# EAGLE design brushless2 (EAGLE 5.10)
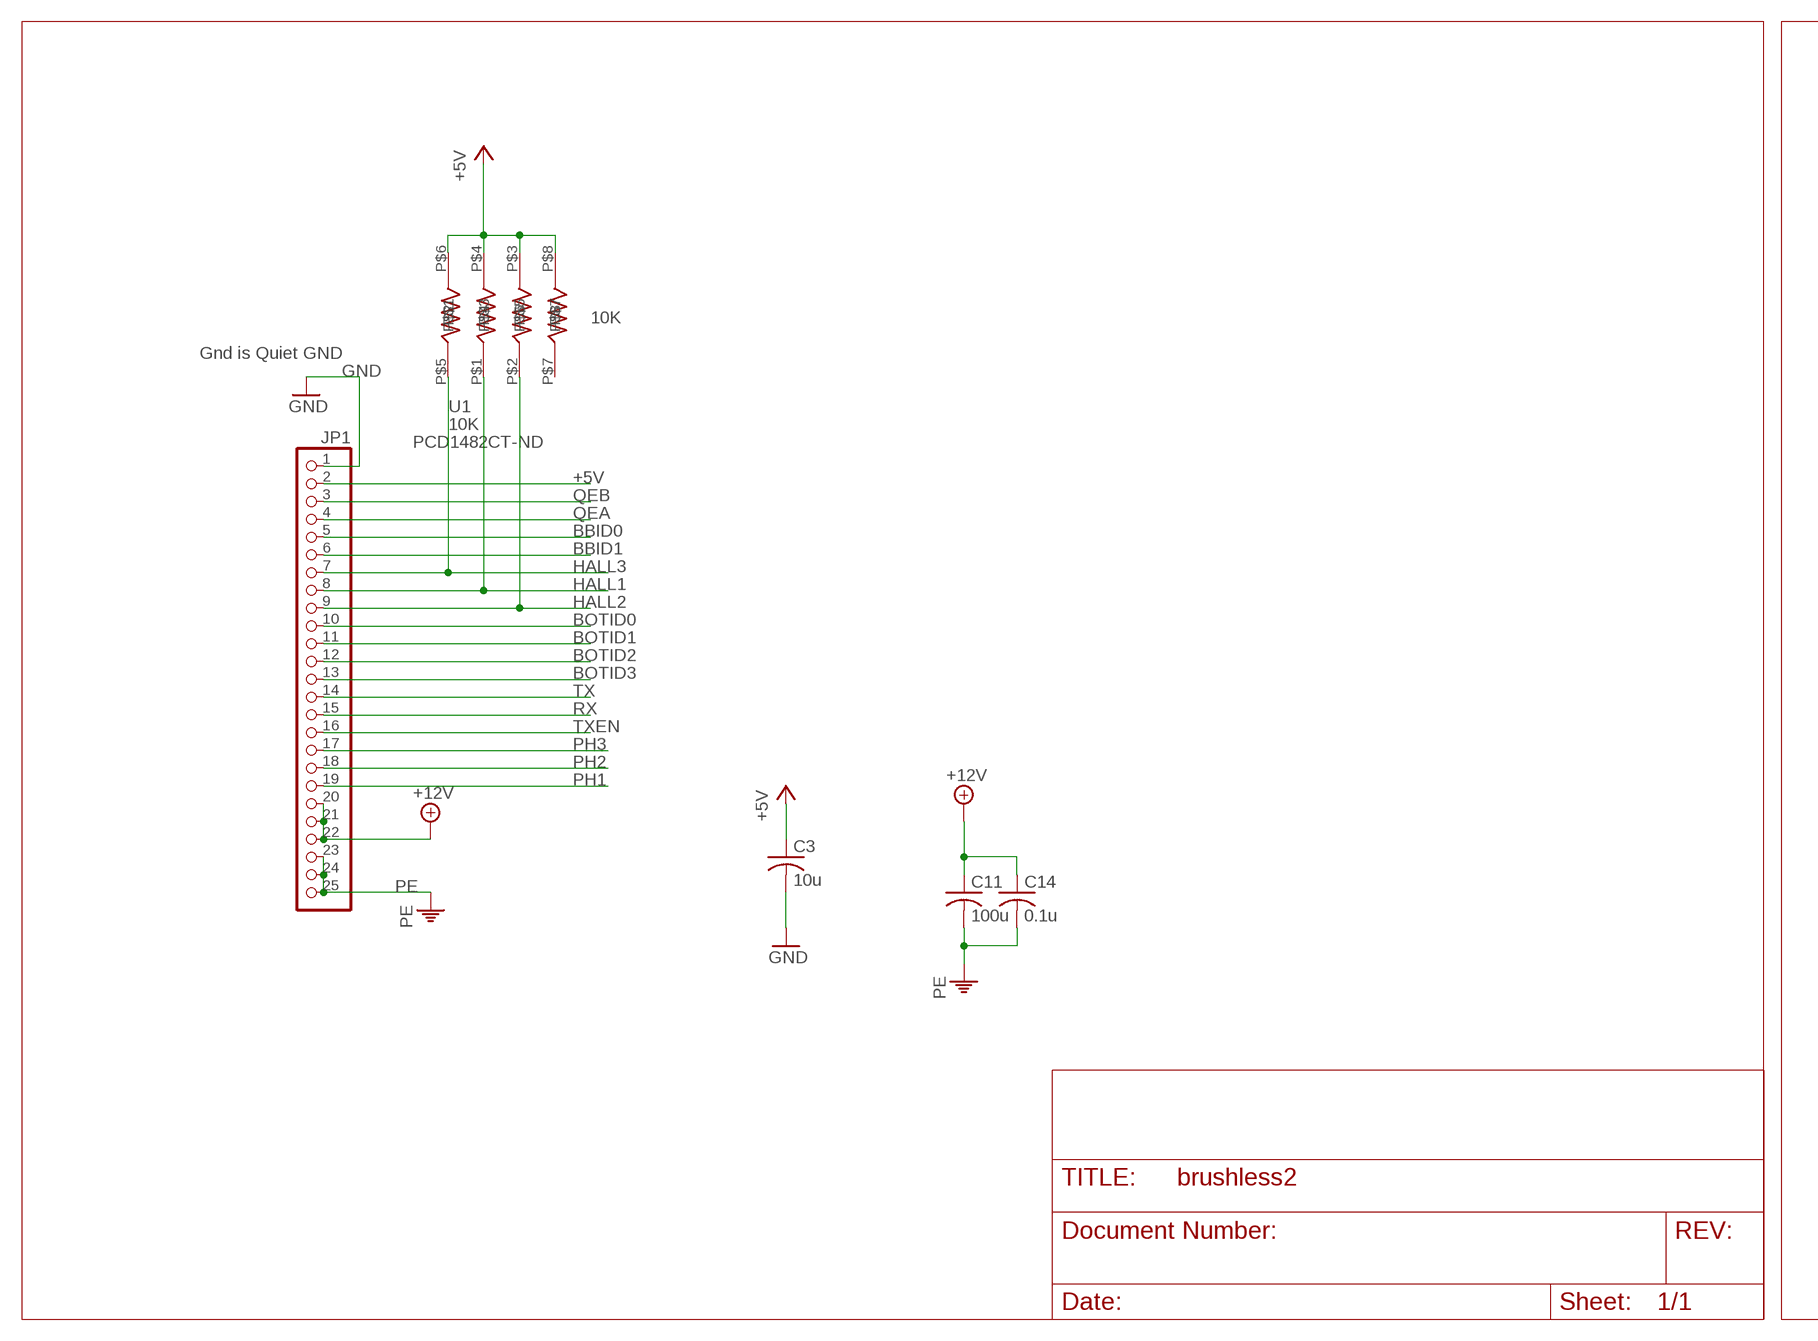
[diagram p0: schematic, sheet 1, part 1 of 2]
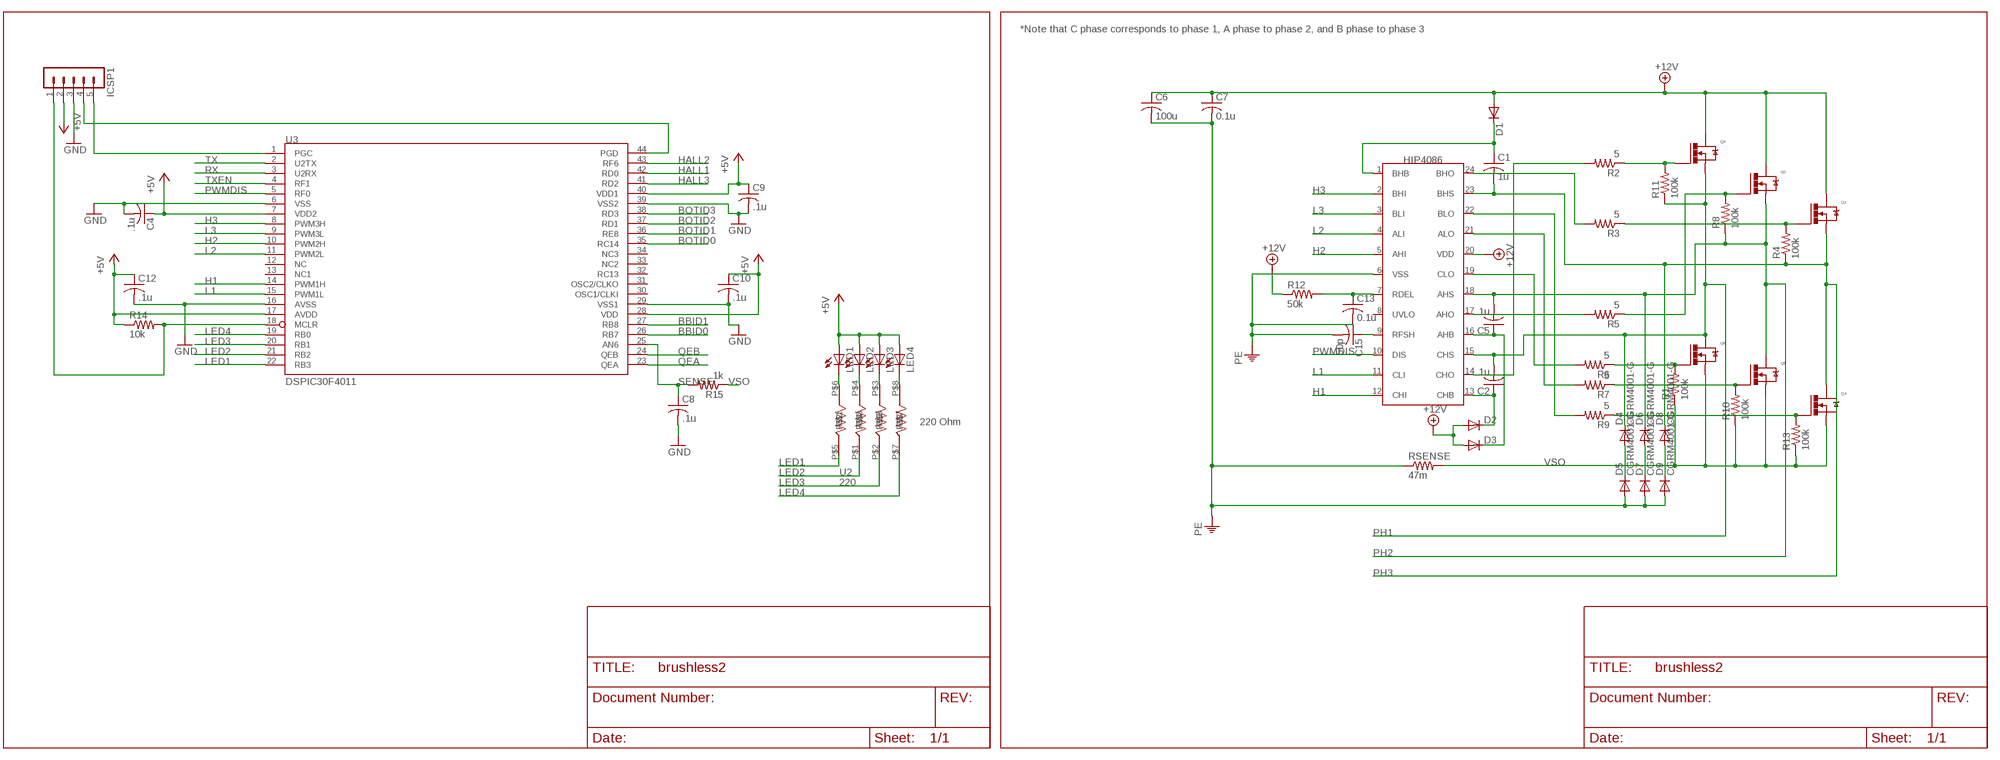
[diagram p1: schematic, sheet 1, part 2 of 2]

## Parts
C1  1u  C-USC1210  [C1210]
C2  1u  C-USC1210  [C1210]
C3  10u  C-USC1210  [C1210]
C4  .1u  C-USC0603  [C0603]
C5  1u  C-USC1210  [C1210]
C6  100u  C-USC2220K  [C2220K]
C7  0.1u  C-USC0805  [C0805]
C8  .1u  C-USC0603  [C0603]
C9  .1u  C-USC0603  [C0603]
C10  .1u  C-USC0603  [C0603]
C11  100u  C-USC2220K  [C2220K]
C12  .1u  C-USC0603  [C0603]
C13  0.1u  C-USC0805  [C0805]
C14  0.1u  C-USC0805  [C0805]
C15  50p  C-USC0805  [C0805]
D1  DIODE-MINIMELF  [MINIMELF]
D2  DIODE-MINIMELF  [MINIMELF]
D3  DIODE-MINIMELF  [MINIMELF]
D4  CGRM4001-G  [SOD-123_MINI-SMA]
D5  CGRM4001-G  [SOD-123_MINI-SMA]
D6  CGRM4001-G  [SOD-123_MINI-SMA]
D7  CGRM4001-G  [SOD-123_MINI-SMA]
D8  CGRM4001-G  [SOD-123_MINI-SMA]
D9  CGRM4001-G  [SOD-123_MINI-SMA]
ICSP1  MA05-1  [MA05-1]
JP1  PINHD-1X25  [1X25]
LED1  LEDCHIPLED_0805  [CHIPLED_0805]
LED2  LEDCHIPLED_0805  [CHIPLED_0805]
LED3  LEDCHIPLED_0805  [CHIPLED_0805]
LED4  LEDCHIPLED_0805  [CHIPLED_0805]
Q1  N-MOSFET  [DPAK]
Q2  N-MOSFET  [DPAK]
Q3  N-MOSFET  [DPAK]
Q4  N-MOSFET  [DPAK]
Q5  N-MOSFET  [DPAK]
Q6  N-MOSFET  [DPAK]
R1  100k  R-US_R0603  [R0603]
R2  5  R-US_R0603  [R0603]
R3  5  R-US_R0603  [R0603]
R4  100k  R-US_R0603  [R0603]
R5  5  R-US_R0603  [R0603]
R6  5  R-US_R0603  [R0603]
R7  5  R-US_R0603  [R0603]
R8  100k  R-US_R0603  [R0603]
R9  5  R-US_R0603  [R0603]
R10  100k  R-US_R0603  [R0603]
R11  100k  R-US_R0603  [R0603]
R12  50k  R-US_R0805  [R0805]
R13  100k  R-US_R0603  [R0603]
R14  10k  R-US_R0805  [R0805]
R15  1k  R-US_R0603  [R0603]
RSENSE  47m  R-US_R2010  [R2010]
U1  10K  YC164J-10KCT-ND  [0603X4]
U2  220  YC164J-10KCT-ND  [0603X4]
U3  DSPIC30F4011  [TQFP44]
U4  HIP4086  [HIP4086]

## Nets
+5V: C3.1 C4.1 C9.1 C10.1 C12.1 ICSP1.2 JP1.2 LED1.A LED2.A LED3.A LED4.A R14.1 U1.P$3 U1.P$4 U1.P$6 U1.P$8 U3.7(VDD2) U3.17(AVDD) U3.28(VDD) U3.40(VDD1)
+12V: C6.1 C7.1 C11.1 C14.1 D1.A D2.A D3.A JP1.20 JP1.21 JP1.22 Q1.DRAIN Q2.DRAIN Q3.DRAIN R12.1 U4.20(VDD)
BBID0: JP1.5 U3.26(RB7)
BBID1: JP1.6 U3.27(RB8)
BOTID0: JP1.10 U3.35(RC14)
BOTID1: JP1.11 U3.36(RE8)
BOTID2: JP1.12 U3.37(RD1)
BOTID3: JP1.13 U3.38(RD3)
GND: C3.2 C4.2 C8.2 C9.2 C10.2 C12.2 ICSP1.3 JP1.1 U3.6(VSS) U3.16(AVSS) U3.29(VSS1) U3.39(VSS2)
H1: U3.14(PWM1H) U4.12(CHI)
H2: U3.10(PWM2H) U4.5(AHI)
H3: U3.8(PWM3H) U4.2(BHI)
HALL1: JP1.8 U1.P$1 U3.42(RD0)
HALL2: JP1.9 U1.P$2 U3.43(RF6)
HALL3: JP1.7 U1.P$5 U3.41(RD2)
L1: U3.15(PWM1L) U4.11(CLI)
L2: U3.11(PWM2L) U4.4(ALI)
L3: U3.9(PWM3L) U4.3(BLI)
LED1: U2.P$5 U3.22(RB3)
LED2: U2.P$1 U3.21(RB2)
LED3: U2.P$2 U3.20(RB1)
LED4: U2.P$7 U3.19(RB0)
MCLR: ICSP1.1 R14.2 U3.18(MCLR)
N$1: C1.1 D1.C U4.1(BHB)
N$2: LED1.C U2.P$6
N$3: LED2.C U2.P$4
N$4: Q1.GATE R3.1 R4.2
N$5: R3.2 U4.24(BHO)
N$6: R9.2 U4.22(BLO)
N$8: LED3.C U2.P$3
N$9: R7.2 U4.21(ALO)
N$11: D4.A D5.C
N$12: Q5.GATE R7.1 R10.2
N$13: Q2.GATE R5.1 R8.2
N$14: R6.2 U4.19(CLO)
N$15: Q4.GATE R9.1 R13.2
N$16: C2.1 D2.C U4.13(CHB)
N$17: R2.2 U4.14(CHO)
N$18: R5.2 U4.17(AHO)
N$19: Q3.GATE R2.1 R11.2
N$20: C5.1 D3.C U4.16(AHB)
N$21: C15.1 U4.9(RFSH)
N$22: C13.1 R12.2 U4.7(RDEL)
N$23: D6.A D7.C
N$24: D8.A D9.C
N$26: LED4.C U2.P$8
N$29: Q6.GATE R1.2 R6.1
PE: C6.2 C7.2 C11.2 C13.2 C14.2 C15.2 D5.A D7.A D9.A JP1.23 JP1.24 JP1.25 RSENSE.1 U4.6(VSS)
PGC: ICSP1.5 U3.1(PGC)
PGD: ICSP1.4 U3.44(PGD)
PH1: C2.2 D4.C JP1.19 Q3.SOURCE Q6.DRAIN R11.1 U4.15(CHS)
PH2: C5.2 D6.C JP1.18 Q2.SOURCE Q5.DRAIN R8.1 U4.18(AHS)
PH3: C1.2 D8.C JP1.17 Q1.SOURCE Q4.DRAIN R4.1 U4.23(BHS)
PWMDIS: U3.5(RF0) U4.10(DIS)
QEA: JP1.4 U3.23(QEA)
QEB: JP1.3 U3.24(QEB)
RX: JP1.15 U3.3(U2RX)
SENSE: C8.1 R15.2 U3.25(AN6)
TX: JP1.14 U3.2(U2TX)
TXEN: JP1.16 U3.4(RF1)
VSO: Q4.SOURCE Q5.SOURCE Q6.SOURCE R1.1 R10.1 R13.1 R15.1 RSENSE.2
Unconnected: U1.P$7 U3.12(NC) U3.13(NC1) U3.30(OSC1/CLKI) U3.31(OSC2/CLKO) U3.32(RC13) U3.33(NC2) U3.34(NC3) U4.8(UVLO)

## Notes on the sheet
- *Note that C phase corresponds to phase 1, A phase to phase 2, and B phase to phase 3
- TX | HALL2 | HIP4086
- RX | HALL1
- 10K | TXEN | HALL3
- PWMDIS | H3
- Gnd is Quiet GND
- BOTID3 | L3
- H3 | BOTID2
- L3 | BOTID1 | L2
- H2 | BOTID0
- PCD1482CT-ND | L2 | H2
- +5V
- H1
- L1
- BBID1
- BBID0
- QEB | PWMDIS
- QEA
- L1
- SENSE | VSO
- H1
- 220 Ohm

## Library data of the parts
C1-C15 = rcl:C-US: CAPACITOR, American symbol
D1-D3 = diode:DIODE-: DIODE
D4-D9 = diode:CGRM400*-G: Molded plasitc,JEDEC SOD-123/Mini SMA Source: Comchip CGRM4001-G.pdf
ICSP1 = con-lstb:MA05-1: PIN HEADER
JP1 = pinhead:PINHD-1X25: PIN HEADER
LED1-LED4 = led:LED: LED OSRAM: - CHIPLED LG R971, LG N971, LY N971, LG Q971, LY Q971, LO R971, LY R971 LH N974, LH R974 LS Q976, LO Q976, LY Q976 LO Q996 - Hyper CHIPLED LW Q18S LB Q993, LB Q99A, LB R99A - SideLED LS A670, LO A670, LY A670, LG A670, LP A670 LB A673, LV A673, LT A673, LW A673 LH A674 LY A675 LS A676, LA A676, LO A676, LY A676, LW A676 LS A679, LY A679, LG A679 - Hyper Micro SIDELED® LS Y876, LA Y876, LO Y876, LY Y876 LT Y87S - SmartLED LW L88C, LW L88S LB L89C, LB L89S, LG L890 LS L89K, LO L89K, LY L89K LS L896, LA L896, LO L896, LY L896 - TOPLED LS T670, LO T670, LY T670, LG T670, LP T670 LSG T670, LSP T670, LSY T670, LOP T670, LYG T670 LG T671, LOG T671, LSG T671 LB T673, LV T673, LT T673, LW T673 LH T674 LS T676, LA T676, LO T676, LY T676, LB T676, LH T676, LSB T676, LW T676 LB T67C, LV T67C, LT T67C, LS T67K, LO T67K, LY T67K, LW E67C LS E67B, LA E67B, LO E67B, LY E67B, LB E67C, LV E67C, LT E67C LW T67C LS T679, LY T679, LG T679 LS T770, LO T770, LY T770, LG T770, LP T770 LB T773, LV T773, LT T773, LW T773 LH T774 LS E675, LA E675, LY E675, LS T675 LS T776, LA T776, LO T776, LY T776, LB T776 LHGB T686 LT T68C, LB T68C - Hyper Mini TOPLED® LB M676 - Mini TOPLED Santana® LG M470 LS M47K, LO M47K, LY M47K Source: http://www.osram.convergy.de LUXEON: - LUMILED® LXK2-PW12-R00, LXK2-PW12-S00, LXK2-PW14-U00, LXK2-PW14-V00 LXK2-PM12-R00, LXK2-PM12-S00, LXK2-PM14-U00 LXK2-PE12-Q00, LXK2-PE12-R00, LXK2-PE12-S00, LXK2-PE14-T00, LXK2-PE14-U00 LXK2-PB12-K00, LXK2-PB12-L00, LXK2-PB12-M00, LXK2-PB14-N00, LXK2-PB14-P00, LXK2-PB14-Q00 LXK2-PR12-L00, LXK2-PR12-M00, LXK2-PR14-Q00, LXK2-PR14-R00 LXK2-PD12-Q00, LXK2-PD12-R00, LXK2-PD12-S00 LXK2-PH12-R00, LXK2-PH12-S00 LXK2-PL12-P00, LXK2-PL12-Q00, LXK2-PL12-R00 Source: www.luxeon.com KINGBRIGHT: KA-3528ASYC Source: www.kingbright.com
Q1-Q6 = rfc:N-MOSFET: N-Channel Power Mosfet
R1-R15 RSENSE = rcl:R-US_: RESISTOR, American symbol
U1 U2 = rfc:YC164J-10KCT-ND: 4 pack of resistors
U3 = rfc:DSPIC30F4011
U4 = rfc:HIP4086

## Board
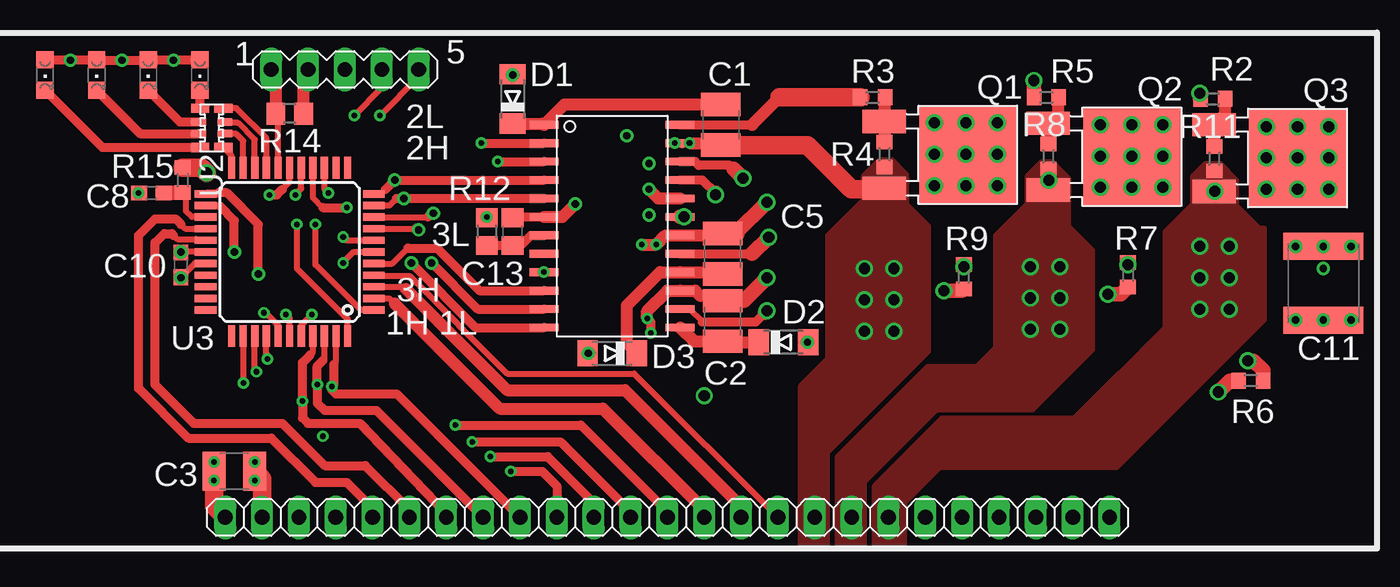
[diagram p2: board, top side]
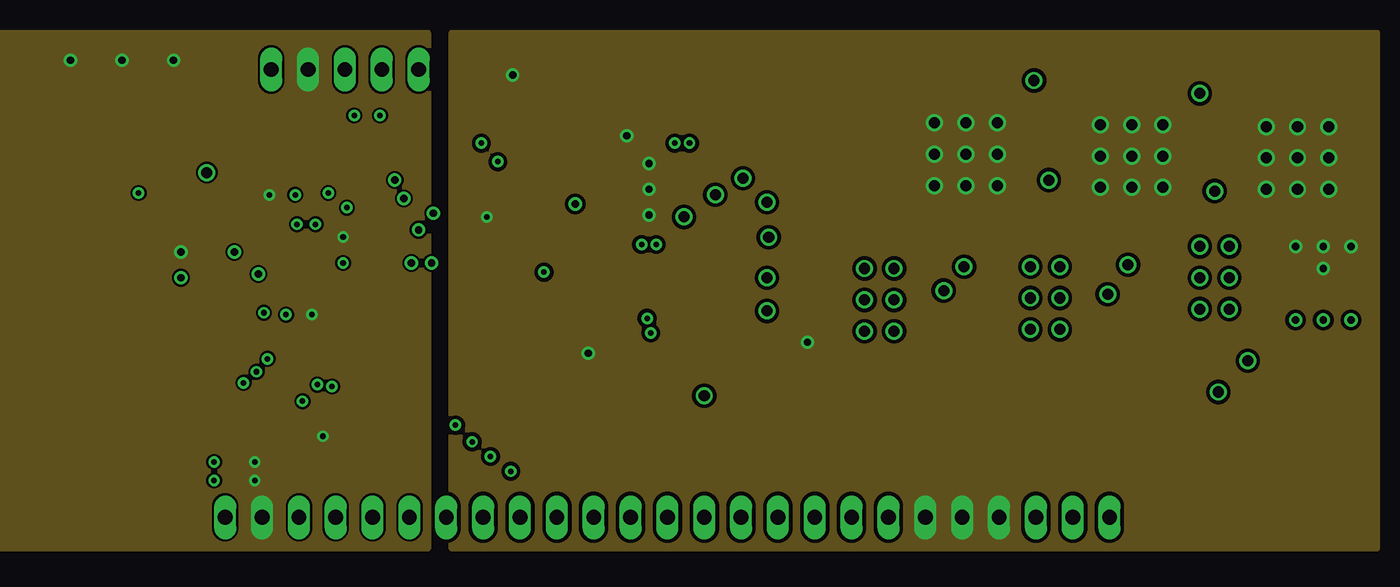
[diagram p3: board, inner layer Route2]
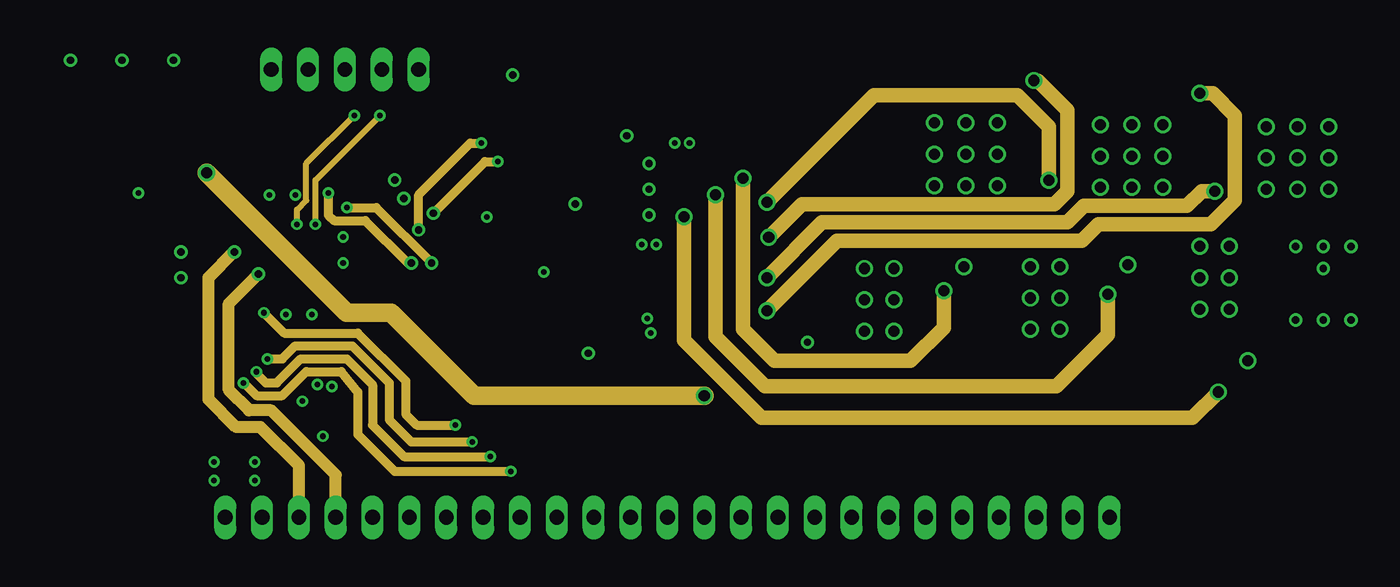
[diagram p4: board, inner layer Route15]
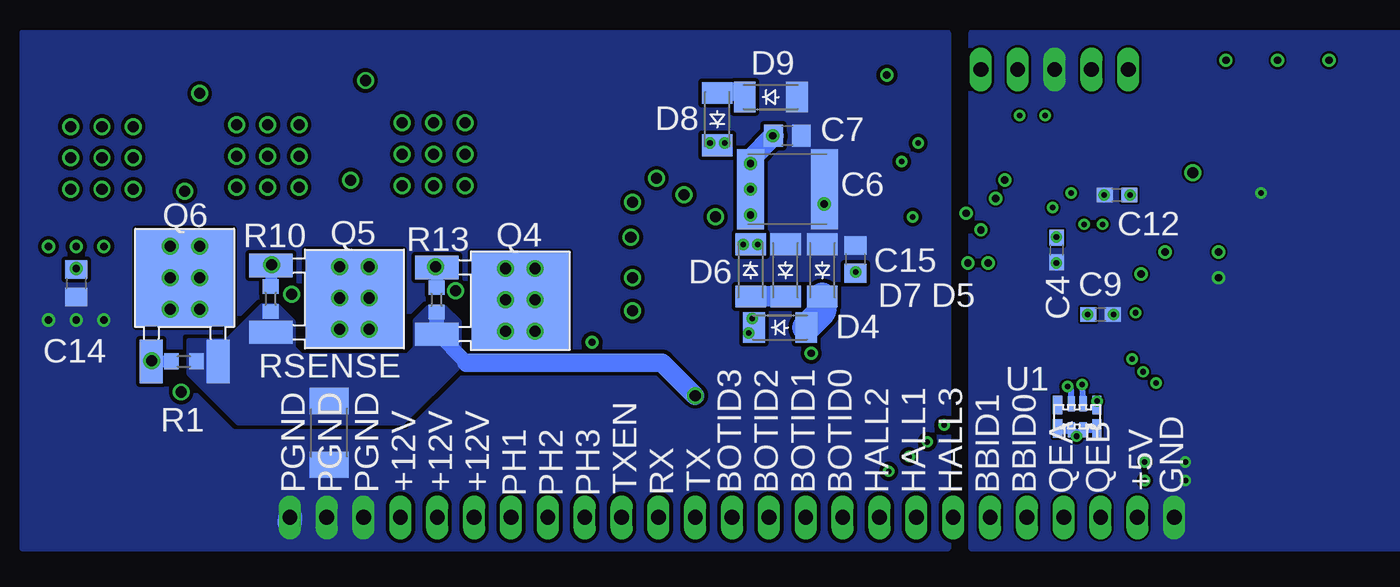
[diagram p5: board, bottom side, seen from below]

No outline drawn. Coordinates in mm, seen from the top.
Copper layers (1*2+15*16): Top 0.035mm / dielectric 0.5mm / Route2 0.035mm / dielectric 0.43mm / Route15 0.035mm / dielectric 0.5mm / Bottom 0.035mm
Design rules "advanced_circuits_4_layer_full *": minimum track width 4mil, minimum drill 8mil, track to track 6mil, track to pad 6mil, pad to pad 6mil, via to via 6mil, smd to smd 0mil, copper to edge 20mil, drill to drill 10mil, minimum pad ring 10mil, minimum via ring 8mil, stop-mask expansion 4mil, vias tented up to drill 0mil, thermal gap 10mil

### Footprints (pad centres in the part's own frame; a part is rotated, then mirrored left to right if it is on the bottom)
C1210 = smd 1.6 x 2.7: 1 -1.4,0; 2 1.4,0
C0603 = smd 1.1 x 1: 1 -0.85,0; 2 0.85,0
C2220K = smd 1.85 x 5.5: 1 -2.55,0; 2 2.55,0
C0805 = smd 1.3 x 1.5: 1 -0.95,0; 2 0.95,0
MINIMELF = smd 1.4 x 1.8: A 1.7,0; C -1.7,0
SOD-123_MINI-SMA = smd 1.5 x 2.1: A 1.8,0; C -1.8,0
MA05-1 = drill 1.016 long: 1 -5.08,0; 2 -2.54,0; 3 0,0; 4 2.54,0; 5 5.08,0
1X25 = drill 1.016 long: 1 -29.21,0; 2 -26.67,0; 3 -24.13,0; 4 -21.59,0; 5 -19.05,0; 6 -16.51,0; 7 -13.97,0; 8 -11.43,0; 9 -8.89,0; 10 -6.35,0; 11 -3.81,0; 12 -1.27,0; 13 1.27,0; 14 3.81,0; 15 6.35,0; 16 8.89,0; 17 11.43,0; 18 13.97,0; 19 16.51,0; 20 19.05,0; 21 21.59,0; 22 24.13,0; 23 26.67,0; 24 29.21,0; 25 31.75,0
CHIPLED_0805 = smd 1.2 x 1.2: A 0,-1.05; C 0,1.05
DPAK = smd 6.7 x 6.7: DRAIN 0,0 | smd 3 x 1.6: GATE 5.75,-2.3; SOURCE 5.75,2.3
R0603 = smd 1 x 1.1: 1 -0.85,0; 2 0.85,0
R0805 = smd 1.3 x 1.5: 1 -0.95,0; 2 0.95,0
R2010 = smd 1.8 x 2.7: 1 -2.2,0; 2 2.2,0
0603X4 = smd 0.508 x 1.016: P$1 1.2,-0.1; P$2 2,-0.1; P$3 2,1.7; P$4 1.2,1.7 | smd 0.635 x 1.27: P$5 0.25,0; P$6 0.25,1.6; P$7 2.95,0; P$8 2.95,1.6
TQFP44 = smd 1.5 x 0.5: 1 -5.8,4; 2 -5.8,3.2; 3 -5.8,2.4; 4 -5.8,1.6; 5 -5.8,0.8; 6 -5.8,0; 7 -5.8,-0.8; 8 -5.8,-1.6; 9 -5.8,-2.4; 10 -5.8,-3.2; 11 -5.8,-4; 23 5.8,-4; 24 5.8,-3.2; 25 5.8,-2.4; 26 5.8,-1.6; 27 5.8,-0.8; 28 5.8,0; 29 5.8,0.8; 30 5.8,1.6; 31 5.8,2.4; 32 5.8,3.2; 33 5.8,4 | smd 0.5 x 1.5: 12 -4,-5.8; 13 -3.2,-5.8; 14 -2.4,-5.8; 15 -1.6,-5.8; 16 -0.8,-5.8; 17 0,-5.8; 18 0.8,-5.8; 19 1.6,-5.8; 20 2.4,-5.8; 21 3.2,-5.8; 22 4,-5.8; 34 4,5.8; 35 3.2,5.8; 36 2.4,5.8; 37 1.6,5.8; 38 0.8,5.8; 39 0,5.8; 40 -0.8,5.8; 41 -1.6,5.8; 42 -2.4,5.8; 43 -3.2,5.8; 44 -4,5.8
HIP4086 = smd 1.981 x 0.533: 1 -4.686,6.985; 2 -4.686,5.715; 3 -4.686,4.445; 4 -4.686,3.175; 5 -4.686,1.905; 6 -4.686,0.635; 7 -4.686,-0.635; 8 -4.686,-1.905; 9 -4.686,-3.175; 10 -4.686,-4.445; 11 -4.686,-5.715; 12 -4.686,-6.985; 13 4.686,-6.985; 14 4.686,-5.715; 15 4.686,-4.445; 16 4.686,-3.175; 17 4.686,-1.905; 18 4.686,-0.635; 19 4.686,0.635; 20 4.686,1.905; 21 4.686,3.175; 22 4.686,4.445; 23 4.686,5.715; 24 4.686,6.985

### Placement (x,y rotation side)
C1  50.04,29.21 270 top
C2  50.16,15.68 90 top
C3  16.51,5.33 180 top
C4  24,20.57 270 bottom
C5  50.16,20.32 90 top
C6  42.55,24.77 0 bottom
C7  42.55,28.45 0 bottom
C8  10.79,24.51 180 top
C9  20.95,16.13 0 bottom
C10  12.83,19.56 270 top
C11  91.57,18.29 270 top
C12  19.81,24.38 180 bottom
C13  35.69,21.84 90 top
C14  91.57,18.29 270 bottom
C15  37.85,19.94 90 bottom
D1  35.69,30.99 90 top
D2  54.36,14.22 0 top
D3  42.55,13.46 180 top
D4  43.05,15.24 0 bottom
D5  40.13,19.18 90 bottom
D6  45.09,19.18 270 bottom
D7  42.67,19.18 90 bottom
D8  47.37,29.59 90 bottom
D9  43.69,31.11 0 bottom
ICSP1  24.13,33.02 0 top
JP1  45.09,2.16 0 top
LED1  3.46,32.64 180 top
LED2  7.02,32.64 180 top
LED3  10.57,32.64 180 top
LED4  14.13,32.64 180 top
Q1  67.06,27.14 180 top
Q2  78.36,27.01 180 top
Q3  89.79,26.91 180 top
Q4  60.96,17.08 180 bottom
Q5  72.39,17.21 180 bottom
Q6  84.09,18.66 270 bottom
R1  84.14,12.9 180 bottom
R2  83.96,30.99 180 top
R3  60.5,31.09 180 top
R4  61.32,27.17 90 top
R5  72.47,31.09 180 top
R6  86.56,11.58 180 top
R7  78.11,18.87 270 top
R8  72.62,27.03 90 top
R9  66.78,18.75 270 top
R10  78.16,17.21 90 bottom
R11  84.05,26.87 90 top
R12  33.91,21.84 270 top
R13  66.73,17.16 90 bottom
R14  20.32,29.97 180 top
R15  12.95,25.4 270 top
RSENSE  74.13,7.98 90 bottom
U1  20.97,9.89 180 bottom
U2  15.75,27.4 90 top
U3  20.32,20.45 180 top
U4  42.55,22.23 0 top

### Tracks (layer width: path | path; a pad name or v marks a point on that pad's centre or on a via)
+5V  (via drill 0.38, 0.51)
  Top 0.406: 19.81,24.77 20.32,25.27 U3.17 | U3.28 v12.83,20.45 | v21.84,16.13 21.12,15.4 U3.40 | v24,21.46 24.22,21.25 U3.7
  Top 0.61: LED1.A 5.21,33.69 | 5.21,33.69 LED2.A | 5.21,33.69 v5.21,33.66 | LED3.A 12.32,33.69 | 12.32,33.69 LED4.A | 12.32,33.69 v12.32,33.66 | 6.99,33.66 v8.76,33.66 10.54,33.66 | v18.92,24.38 19.43,24.38 19.81,24.77
  Top 0.813: v12.83,20.45 C10.1 | R14.1 21.27,32.7 ICSP1.2
  Top 1.27: JP1.2 18.41,4.83 C3.1
  Bottom 0.61: U1.P$6 22.07,8.29 U1.P$4 v22.61,7.75 22.61,7.82 U1.P$3 23.82,8.19 U1.P$8 | C4.1 v24,21.46
  Bottom 0.813: v21.84,16.13 C9.1 | C12.1 v18.92,24.38
  other vias: 17.91,5.97 17.91,4.7
  pour Route2 (no thermals): 0,35.56 29.84,35.56 29.84,0 0,0
+12V  (via drill 0.38, 0.51, 0.76)
  Top 0.813: U4.20 45.72,24.13 C6.1 | v66.93,27.18 67.02,27.18 Q1.DRAIN | D1.A v35.69,32.64 | R12.1 v33.91,22.86 | D3.A v40.89,13.46 | D2.A v56.01,14.22 | v78.36,27.05 Q2.DRAIN | v89.79,26.92 Q3.DRAIN | C11.1 v91.57,20.83
  Bottom 0.813: C14.1 v91.57,19.3 | C6.1
  Bottom 1.422: C6.1 45.09,26.85 C7.1
  other vias: 43.56,28.45 45.09,26.54 45.09,24.77 45.09,22.99 64.77,29.34 66.93,29.34 69.09,29.34 64.77,27.18 69.09,27.18 69.09,25.02 66.93,25.02 64.77,25.02 76.2,29.21 78.36,29.21 80.52,29.21 80.52,27.05 76.2,27.05 76.2,24.89 78.36,24.89 80.52,24.89 87.63,29.08 89.79,29.08 91.95,29.08 87.63,26.92 91.95,26.92 87.63,24.77 89.79,24.77 91.95,24.77 89.66,20.83 93.47,20.83
  pour Route2 (isolate 0.254, no thermals): 31.5,35.56 95.25,35.56 95.25,0 31.5,0
BBID0
  Top 0.406: 12.83,22.35 13.13,22.05 U3.26
  Top 0.61: JP1.5 26.04,2.79 24.26,4.57 22.1,4.57 19.05,7.62 13.34,7.62 9.91,11.05 9.91,21.59 11.05,22.73 12.45,22.73 12.83,22.35
BBID1
  Top 0.406: 12.32,21.59 12.57,21.34 13.84,21.34 13.93,21.25 U3.27
  Top 0.61: JP1.6 28.57,2.67 25.53,5.71 22.73,5.71 19.81,8.64 13.72,8.64 11.05,11.3 11.05,21.08 11.68,21.72 12.19,21.72 12.32,21.59
BOTID0  (via drill 0.38)
  Top 0.406: v17.14,11.43 17.14,14.62 U3.35
  Top 0.61: JP1.10 38.73,4.32 37.72,5.33 v35.56,5.33
  Route15 0.61: v35.56,5.33 27.56,5.33 25.02,7.87 25.02,10.79 23.88,12.19 21.46,12.19 19.81,10.54 18.03,10.54 v17.14,11.43
BOTID1  (via drill 0.38)
  Top 0.406: 17.91,14.63 U3.36 17.92,12.31 v18.03,12.19
  Top 0.61: JP1.11 41.27,3.17 38.1,6.35 v34.16,6.35
  Route15 0.61: v34.16,6.35 28.19,6.35 26.04,8.51 26.04,11.3 24.26,13.08 21.08,13.08 19.43,11.43 18.67,11.43 18.03,12.06 v18.03,12.19
BOTID2  (via drill 0.38)
  Top 0.406: v18.8,13.08 18.8,13.34 18.67,13.46 18.67,14.6 U3.37
  Top 0.61: JP1.12 43.81,2.54 38.99,7.37 v32.89,7.37
  Route15 0.61: v32.89,7.37 28.7,7.37 27.18,8.89 27.18,11.43 24.64,13.97 20.7,13.97 19.81,13.08 v18.8,13.08
BOTID3  (via drill 0.38)
  Top 0.406: v18.54,16.26 18.67,16.26 19.56,15.37 19.56,14.69 U3.38
  Top 0.61: JP1.13 46.35,2.54 40.39,8.51 v31.75,8.51
  Route15 0.61: v31.75,8.51 29.08,8.51 28.32,9.27 28.32,11.56 25.02,14.86 19.94,14.86 v18.54,16.26
GND  (via drill 0.38, 0.51)
  Top 0.406: U3.16 21.12,24.8 v20.7,24.38 | C10.2 13.77,19.65 U3.29 | U3.39 20.32,15.88 v20.07,16.13 | U3.6 24.73,20.45 C4.2 v24,19.68
  Top 0.813: C10.2 v12.83,18.67 | C8.2 v9.91,24.51
  Top 1.27: C3.2 15.11,2.92 JP1.1
  other vias: 15.11,5.97 15.11,4.7
  pour Bottom (no thermals): 0,0 29.84,0 29.84,35.56 0,35.56
H1  (via drill 0.38, 0.51)
  Top 0.406: U3.14 22.72,24.78 v22.99,24.51
  Top 0.61: v28.7,19.68 33.15,15.24 U4.12
  Route15 0.61: v22.99,24.51 22.99,22.99 23.37,22.61 25.53,22.61 28.45,19.68 v28.7,19.68
H2  (via drill 0.51)
  Top 0.406: U3.10 27.2,23.65 27.69,24.13
  Top 0.61: 27.69,24.13 v28.19,24.13 U4.5
H3  (via drill 0.38, 0.51)
  Top 0.406: U3.8 29.01,22.05
  Top 0.61: v33.53,27.94 U4.2 | 29.01,22.05 29.13,22.05 v29.21,21.97
  Route15 0.61: v33.53,27.94 32.77,27.94 29.21,24.38 v29.21,21.97
HALL1  (via drill 0.38)
  Top 0.406: 22.61,12.95 22.72,13.07 U3.42
  Top 0.61: JP1.8 26.29,9.53 22.73,9.53 22.23,10.03 v22.23,11.3 22.23,12.57 22.61,12.95
  Bottom 0.406: v22.23,11.3 22.17,10.49 U1.P$1
HALL2  (via drill 0.38)
  Top 0.406: 23.37,12.7 23.52,12.85 U3.43
  Top 0.61: JP1.9 27.69,10.67 23.5,10.67 23.24,10.92 v23.24,11.18 23.37,11.3 23.37,12.7
  Bottom 0.406: v23.24,11.18 22.97,10.91 U1.P$2
HALL3  (via drill 0.38)
  Top 0.406: 21.72,13.34 21.92,13.54 U3.41
  Top 0.61: JP1.7 31.11,2.41 25.15,8.64 21.59,8.64 21.21,9.02 v21.21,10.16 21.21,12.83 21.72,13.34
  Bottom 0.406: v21.21,10.16 21.22,10.15 U1.P$5
L1  (via drill 0.38, 0.51)
  Top 0.406: 22.61,23.5 21.92,24.18 U3.15
  Top 0.61: 22.61,23.5 v24.26,23.5 | v30.1,19.68 33.27,16.51 U4.11
  Route15 0.61: v24.26,23.5 26.29,23.5 v30.1,19.68
L2  (via drill 0.51)
  Top 0.406: U3.11 26.61,24.45 26.92,24.77
  Top 0.61: 26.92,24.77 v27.56,25.4 U4.4
L3  (via drill 0.38, 0.51)
  Top 0.406: U3.9 29.83,22.85
  Top 0.61: v34.67,26.67 U4.3 | 29.83,22.85 30.1,23.11 v30.23,23.11
  Route15 0.61: v30.23,23.11 33.78,26.67 v34.67,26.67
LED1
  Top 0.406: U3.22 16.32,27.08 U2.P$5
LED2
  Top 0.406: U3.21 17.12,28.09 16.64,28.57 15.87,28.57 U2.P$1
LED3
  Top 0.406: U3.20 17.92,28.18 16.76,29.34 15.91,29.34 U2.P$2
LED4
  Top 0.406: U3.19 18.72,28.27 16.64,30.35 U2.P$7
MCLR
  Top 0.406: U3.18 19.52,29.82 R14.2
  Top 0.813: R14.2 19.37,32.7 ICSP1.1
  Top 1.016: ICSP1.1 19.24,32.83
N$1
  Top 0.61: 37.78,29.29 U4.1
  Top 0.813: D1.C 37.78,29.29 | U4.1 39.26,30.61 C1.1
N$2
  Top 0.61: U2.P$6 7.4,27.65 LED1.C
N$3
  Top 0.61: U2.P$4 10.01,28.6 LED2.C
N$4
  Top 0.813: R4.2 61.31,28.02 Q1.GATE 61.35,29.48 R3.1
N$5
  Top 0.61: U4.24 52.2,29.21
  Top 0.813: 52.2,29.21 54.08,31.09
  Top 1.27: 54.08,31.09 R3.2
N$6  (via drill 0.76)
  Top 0.61: U4.22 48.26,26.67 48.51,26.42 50.67,26.42 50.93,26.16
  Top 1.016: v51.56,25.53 50.93,26.16 | v65.41,17.78 66.66,17.78 R9.2
  Route15 1.016: v51.56,25.53 51.56,15.11 53.72,12.95 63.12,12.95 65.41,15.24 v65.41,17.78
N$8
  Top 0.61: U2.P$3 12.76,29.4 LED3.C
N$9  (via drill 0.76)
  Top 0.61: U4.21 48.77,25.4 49.66,24.51
  Top 1.016: v49.66,24.38 49.66,24.51 | v76.71,17.53 77.61,17.53 R7.2
  Route15 1.016: v49.66,24.38 49.66,14.61 53.09,11.18 73.15,11.18 76.71,14.73 v76.71,17.53
N$11
  Bottom 1.93: D5.C 40.13,16.36 D4.A
N$12  (via drill 0.76)
  Top 1.016: R7.1 v78.11,19.56
  Bottom 0.813: Q5.GATE 78.14,18.07 R10.2
  Bottom 1.016: v78.11,19.56 78.11,19.54 Q5.GATE
N$13
  Top 0.813: R8.2 Q2.GATE 73.32,30.01 R5.1
N$14  (via drill 0.76)
  Top 1.016: v47.5,22.86 U4.19 | v84.33,10.79 85.11,11.58 R6.2
  Route15 1.016: v47.5,22.86 47.5,14.35 52.83,9.02 82.55,9.02 v84.33,10.79
N$15  (via drill 0.76)
  Top 1.016: R9.1 66.78,19.46 v66.8,19.43
  Bottom 0.813: R13.2 66.71,18.02 Q4.GATE
  Bottom 1.016: v66.8,19.43 66.76,19.43 Q4.GATE
N$16
  Top 0.61: C2.1 50.23,14.22
  Top 0.813: U4.13 48.19,14.28 C2.1 | 50.23,14.22 D2.C
N$17  (via drill 0.76)
  Top 0.406: U4.14 47.88,16.51 48.77,15.62
  Top 0.61: 48.77,15.62 52.45,15.62 53.09,16.26
  Top 1.016: 53.09,16.26 v53.21,16.38 | v83.06,31.37 83.06,31.04 R2.2
  Route15 1.016: v53.21,16.38 58.04,21.21 74.93,21.21 76.07,22.35 83.82,22.35 85.47,24 85.47,29.84 83.95,31.37 v83.06,31.37
N$18  (via drill 0.76)
  Top 0.61: U4.17 52.2,20.32
  Top 1.016: 52.2,20.32 v53.34,21.46 | v71.63,32.26 71.62,32.25 R5.2
  Route15 1.016: v53.34,21.46 55.63,23.75 73.03,23.75 73.91,24.64 73.91,30.23 71.88,32.26 v71.63,32.26
N$19
  Top 0.813: R11.2 84.04,27.98 Q3.GATE 84.81,29.98 R2.1
N$20
  Top 0.61: 50.16,19.05 C5.1
  Top 0.813: D3.C 43.56,14.15 43.56,16.76 45.85,19.05 U4.16 50.16,19.05
N$21  (via drill 0.38)
  Top 0.61: v37.85,19.05 U4.9
  Bottom 0.61: C15.1 v37.85,19.05
N$22
  Top 0.61: R12.2 C13.1 36.26,20.89 36.96,21.59 U4.7
N$23
  Bottom 1.422: D7.C D6.A
N$24
  Bottom 1.27: D9.C 45.59,31.11 45.59,31.5 47.37,31.5 D8.A
N$26
  Top 0.61: U2.P$8 14.15,31.57 LED4.C
N$29  (via drill 0.76)
  Top 1.016: R6.1 87.41,12.28 86.74,12.95 v86.36,12.95
  Bottom 0.813: Q6.GATE R1.2
  Bottom 1.016: v86.36,12.95 86.39,12.93 Q6.GATE
PE  (via drill 0.51)
  Top 0.61: U4.6 35.75,22.86 C13.2
  Top 0.813: U4.6 39.12,22.86 v40.01,23.75 | C11.2 v91.57,15.75
  Bottom 1.676: JP1.25 76.87,1.78
  other vias: 89.66,15.75 93.47,15.75
  pour Bottom (isolate 0.254, rank 2, no thermals): 31.5,35.56 31.5,0 95.25,0 95.25,35.56
PGC  (via drill 0.38)
  Top 0.406: U3.1 25.21,16.45 22.1,19.56 v22.1,22.35 | v26.54,29.84 29.21,32.51 ICSP1.5
  Route15 0.406: v22.1,22.35 22.1,25.4 v26.54,29.84
PGD  (via drill 0.38)
  Top 0.406: U3.44 24.32,15.81 20.83,19.3 v20.83,22.35 | v24.77,29.84 26.67,31.75 ICSP1.4
  Route15 0.406: v20.83,22.35 20.83,23.37 21.46,24 21.46,26.54 v24.77,29.84
PH1  (via drill 0.38, 0.76)
  Top 0.61: v45.21,14.86 45.21,15.62 v44.96,15.88 | 48.64,17.4 49.85,17.4 C2.2
  Top 0.813: v44.96,15.88 44.96,16.38 46.35,17.78 U4.15 48.26,17.78 48.64,17.4
  Top 1.016: C2.2 51.63,17.08 v53.21,18.67
  Route15 1.016: v53.21,18.67 57.02,22.48 73.91,22.48 75.06,23.62 82.17,23.62 83.19,24.64 v84.07,24.64
  Bottom 0.61: D4.C 44.85,15.77 v44.96,15.88
  Bottom 0.813: v85.09,18.67 83.95,18.8 Q6.DRAIN
  other vias: 83.06,20.83 85.09,20.83 83.06,18.67 83.06,16.51 85.09,16.51
  pour Top (rank 3, no thermals): 60.58,0 60.58,4.32 65.28,9.02 74.42,9.02 80.64,15.24 80.64,21.84 82.55,23.75 82.55,25.65 83.44,26.54 84.45,26.54 85.6,25.4 85.6,23.62 87.12,22.1 87.5,22.1 87.5,15.75 77.34,5.59 65.15,5.59 62.74,3.17 62.74,0
PH2  (via drill 0.38, 0.76)
  Top 0.61: 50.16,21.59 C5.2
  Top 0.813: v44.58,20.95 v45.59,20.95 46.23,21.59 U4.18 50.16,21.59
  Top 1.016: 51.06,21.72 v53.21,23.88
  Top 1.27: C5.2 51.06,21.72
  Route15 1.016: v53.21,23.88 60.58,31.24 70.48,31.24 72.64,29.08 v72.64,25.4
  Bottom 0.813: v44.58,20.95 45.06,20.95 D6.C | v73.41,17.27 72.33,17.27 Q5.DRAIN
  other vias: 71.37,19.43 73.41,19.43 71.37,17.27 71.37,15.11 73.41,15.11
  pour Top (rank 2, no thermals): 59.94,0 58.04,0 58.04,6.35 64.26,12.57 67.69,12.57 68.96,13.84 68.96,21.59 71.12,23.75 71.12,25.65 72.14,26.67 72.9,26.67 74.04,25.53 74.04,22.23 75.69,20.57 75.69,13.72 71.5,9.53 64.9,9.53 59.94,4.57
PH3  (via drill 0.38, 0.76)
  Top 0.406: v47.88,27.94 U4.23 | U4.23 v46.86,27.94 | U4.23 47.37,27.94 D8.C
  Top 0.61: 50.04,27.94 C1.2
  Top 0.813: v47.88,27.94 50.04,27.94
  Top 1.27: C1.2 56.01,27.81 59.05,24.77 61.24,24.77 Q1.SOURCE
  Bottom 0.406: D8.C 47.73,27.79 v47.88,27.94
  Bottom 0.813: Q4.DRAIN v61.98,17.14
  other vias: 59.94,17.14 61.98,14.99 59.94,14.99 59.94,19.3 61.98,19.3
  pour Top (no thermals): 55.5,3.81 55.5,0 57.4,0 57.4,6.6 64.39,13.59 64.39,22.23 62.87,23.75 62.87,25.78 61.85,26.8 60.96,26.8 59.82,25.65 59.82,24 57.4,21.59 57.4,13.08 55.5,11.18
PWMDIS
  Top 0.406: U3.5 27.39,19.65 28.45,20.7
  Top 0.61: U4.10 33.4,17.78 30.48,20.7 28.45,20.7
QEA  (via drill 0.51)
  Top 0.406: 15.37,24.51 14.58,24.51 U3.23
  Top 0.61: v18.16,18.92 18.16,22.35 16,24.51 15.37,24.51
  Route15 0.813: JP1.4 23.5,5.08 19.05,9.53 17.53,9.53 16.13,10.92 16.13,16.89 v18.16,18.92
QEB  (via drill 0.51)
  Top 0.406: 15.49,23.62 14.54,23.62 U3.24
  Top 0.61: v16.51,20.45 16.51,22.61 15.49,23.62
  Route15 0.813: JP1.3 20.95,5.71 18.29,8.38 16.64,8.38 14.73,10.29 14.73,18.67 v16.51,20.45
RX
  Top 0.406: 28.32,17.91 28.18,18.05 U3.3
  Top 0.813: 28.32,17.91 35.31,10.92 43.43,10.92 51.44,2.92 JP1.15
SENSE
  Top 0.406: 13.18,24.32 13.18,23.27 13.59,22.86 14.51,22.86 U3.25
  Top 0.61: 13.18,24.32 R15.2
  Top 1.016: R15.2 12.91,24.51 C8.1
TX
  Top 0.406: 27.56,16.89 27.2,17.25 U3.2
  Top 0.813: 48.9,2.67 41.91,9.65 34.8,9.65 27.56,16.89
  Top 1.016: 48.9,2.67 JP1.14
TXEN
  Top 0.406: JP1.16 44.07,12.06 35.31,12.06 28.57,18.8 26.17,18.8 U3.4
VSO  (via drill 0.76)
  Top 1.27: v14.61,25.91 14.26,26.25 R15.1
  Route15 1.27: v14.61,25.91 24.26,16.26 27.3,16.26 33.02,10.54 v48.9,10.54
  Bottom 1.016: R13.1 66.73,14.91 64.64,12.83
  Bottom 1.27: 64.64,12.83 51.18,12.83 v48.9,10.54
  pour Bottom (no thermals): 65.15,15.62 65.15,12.57 69.09,8.64 80.39,8.64 83.82,12.06 83.82,14.35 81.15,14.35 78.74,16.76 77.72,16.76 76.58,15.62 76.58,13.84 76.07,13.34 68.71,13.34 68.2,13.84 68.2,15.75 67.31,16.64 66.17,16.64

### Text on the board
tPlace: 2L | 2H | 3L | 3H | 1H | 1L
bNames: PGND | PGND | PGND | TXEN | +12V | +12V | +12V | +5V | PH3 | PH2 | PH1 | TX | RX | GND | QEB | QEA | BBID0 | BBID1 | HALL3 | HALL1 | HALL2 | BOTID0 | BOTID1 | BOTID2 | BOTID3